# EAGLE design rev6_1 (EAGLE 9.6.2)
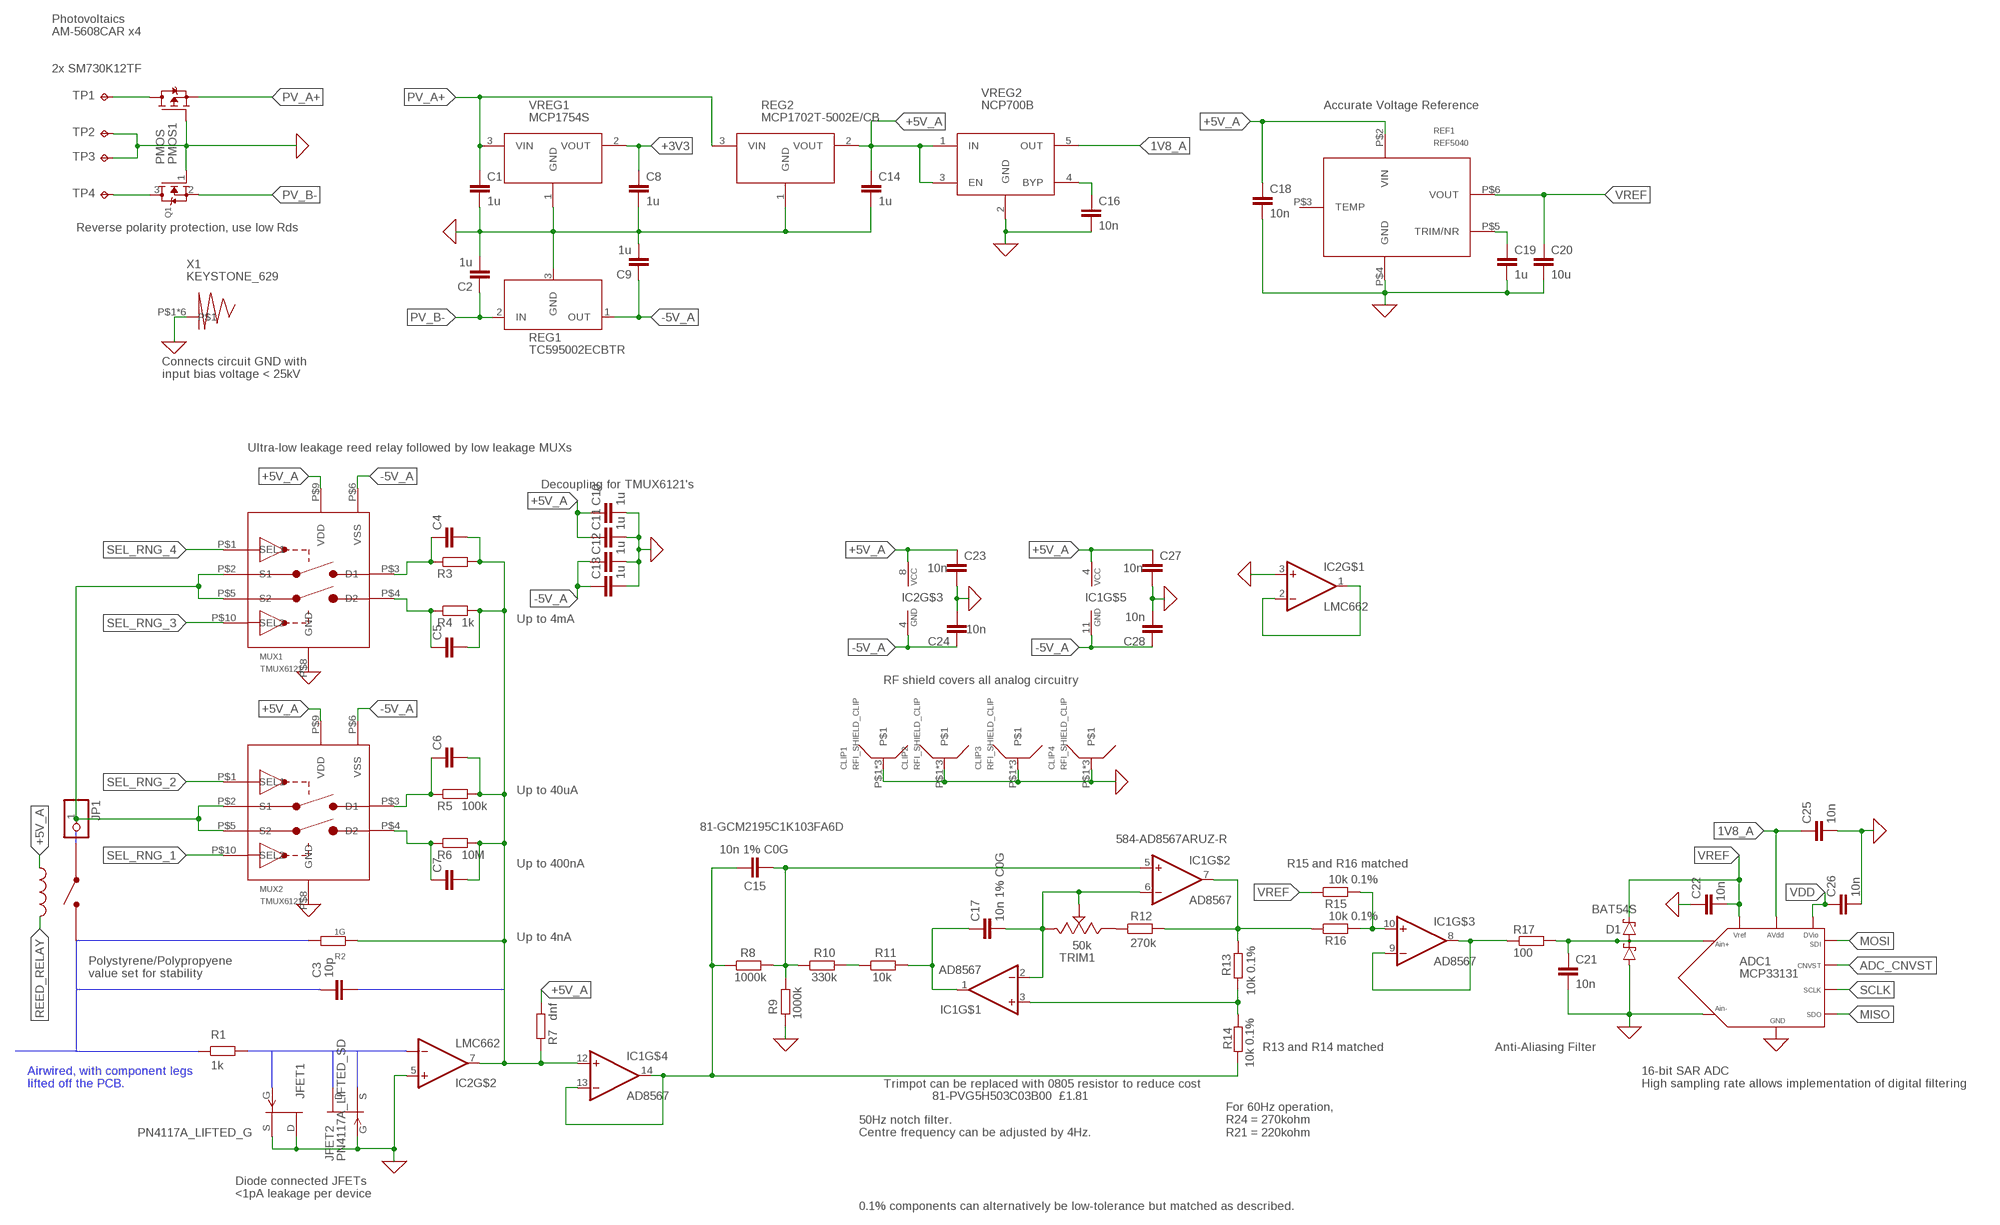
[diagram p0: schematic, sheet 1, part 1 of 2]
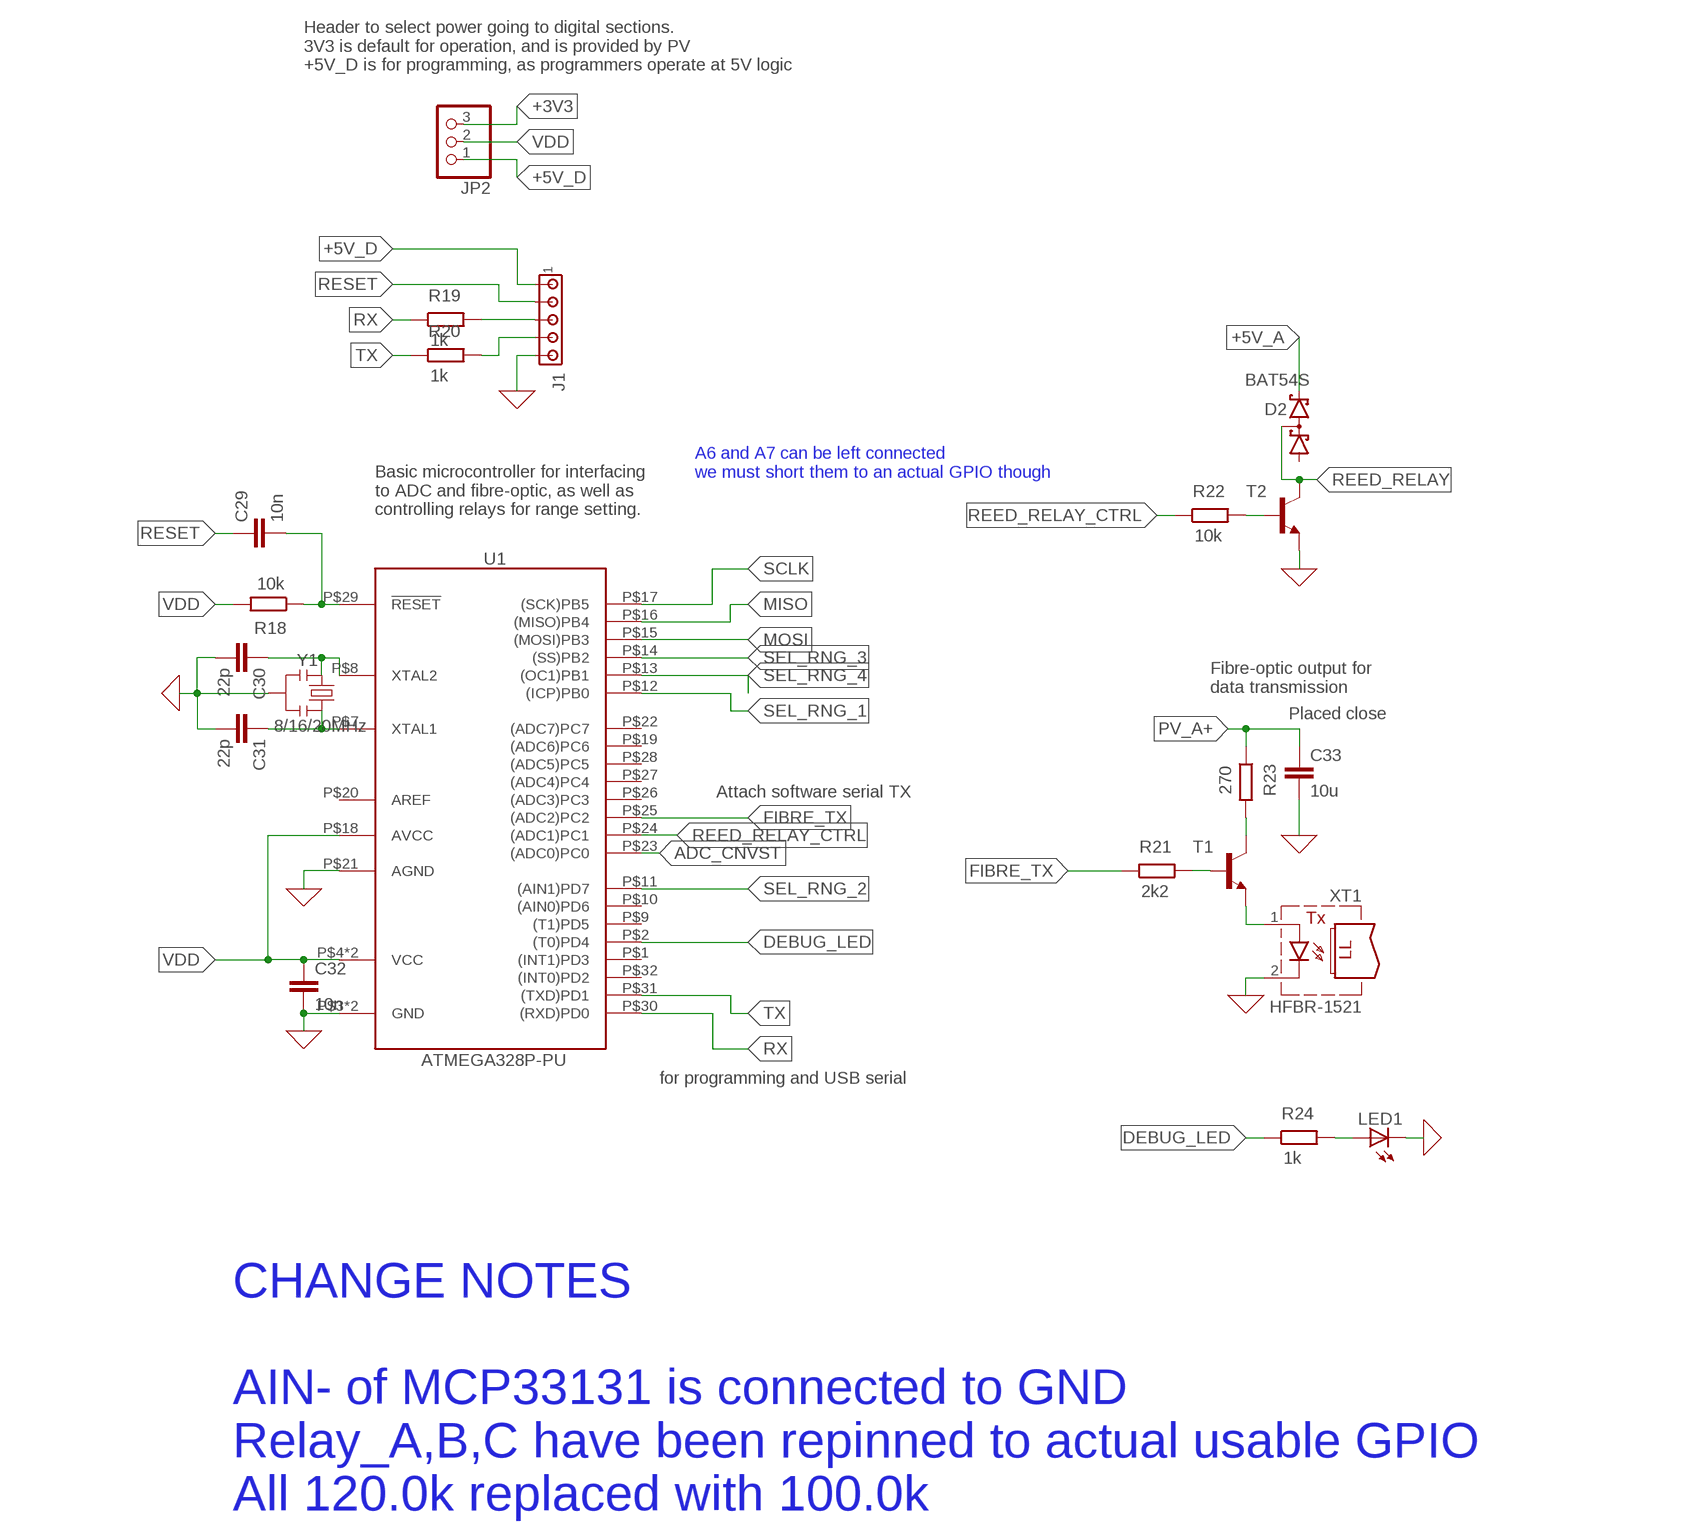
[diagram p1: schematic, sheet 1, part 2 of 2]

## Parts
ADC1  MCP33131  [MSOP10]
C1  1u  C-EUC0805  [C0805]
C2  1u  C-EUC0805  [C0805]
C3  10p  C  (no package)
C4  C-EUC0805  [C0805]
C5  C-EUC0805  [C0805]
C6  C-EUC0805  [C0805]
C7  C-EUC0805  [C0805]
C8  1u  C-EUC0805  [C0805]
C9  1u  C-EUC0805  [C0805]
C10  1u  C-EUC0805  [C0805]
C11  1u  C-EUC0805  [C0805]
C12  1u  C-EUC0805  [C0805]
C13  1u  C-EUC0805  [C0805]
C14  1u  C-EUC0805  [C0805]
C15  10n 1% C0G  C-EUC1206  [C1206]
C16  10n  C-EUC0805  [C0805]
C17  10n 1% C0G  C-EUC1206  [C1206]
C18  10n  C-EUC0805  [C0805]
C19  1u  C-EUC0805  [C0805]
C20  10u  C-EUC0805  [C0805]
C21  10n  C-EUC0805  [C0805]
C22  10n  C-EUC0805  [C0805]
C23  10n  C-EUC0805  [C0805]
C24  10n  C-EUC0805  [C0805]
C25  10n  C-EUC0805  [C0805]
C26  10n  C-EUC0805  [C0805]
C27  10n  C-EUC0805  [C0805]
C28  10n  C-EUC0805  [C0805]
C29  10n  C-EUC0805  [C0805]
C30  22p  C-EUC0805  [C0805]
C31  22p  C-EUC0805  [C0805]
C32  10n  C-EUC0805  [C0805]
C33  10u  C-EUC0805  [C0805]
CLIP1  RFI_SHIELD_CLIP  [RFI_SHIELD_CLIP]
CLIP2  RFI_SHIELD_CLIP  [RFI_SHIELD_CLIP]
CLIP3  RFI_SHIELD_CLIP  [RFI_SHIELD_CLIP]
CLIP4  RFI_SHIELD_CLIP  [RFI_SHIELD_CLIP]
D1  BAT54S  [SOT23]
D2  BAT54S  [SOT23]
IC1  AD8567  TLV9354QPWRQ1  [TSSOP14]
IC2  LMC662  [DIL8_LIFTED]
J1  MTA05-100  [10X05MTA]
JFET1  PN4117A_LIFTED_G  [TO-92_LIFTED_GATE]
JFET2  PN4117A_LIFTED_SD  [TO92_LIFTED_SOURCE_DRAIN]
JP1  PINHD-1X1  [1X01]
JP2  PINHD-1X3  [1X03]
LED1  LEDCHIPLED_0805  [CHIPLED_0805]
MUX1  TMUX6121  [VSSOP-10]
MUX2  TMUX6121  [VSSOP-10]
PMOS1  PMOS  [SOT23]
Q1  MOSFET-NREFLOW  [SOT23]
R1  1k  R  (no package)
R2  1G  THICK_FILM_RESISTOR  [1GOHM_HALF_LIFTED]
R3  R-EU_R0805  [R0805]
R4  1k  R-EU_R0805  [R0805]
R5  100k  R-EU_R0805  [R0805]
R6  10M  R-EU_R0805  [R0805]
R7  dnf  R-EU_R0805  [R0805]
R8  1000k  R-EU_R0805  [R0805]
R9  1000k  R-EU_R0805  [R0805]
R10  330k  R-EU_R0805  [R0805]
R11  10k  R-EU_R0805  [R0805]
R12  270k  R-EU_R0805  [R0805]
R13  10k 0.1%  R-EU_R0805  [R0805]
R14  10k 0.1%  R-EU_R0805  [R0805]
R15  10k 0.1%  R-EU_R0805  [R0805]
R16  10k 0.1%  R-EU_R0805  [R0805]
R17  100  R-EU_R0805  [R0805]
R18  10k  R-EU_R0805  [R0805]
R19  1k  R-EU_R0805  [R0805]
R20  1k  R-EU_R0805  [R0805]
R21  2k2  R-EU_R0805  [R0805]
R22  10k  R-EU_R0805  [R0805]
R23  270  R-EU_R0805  [R0805]
R24  1k  R-EU_R0805  [R0805]
REF1  REF5040  [VSSOP-8_]
REG1  TC595002ECBTR  [SOT23]
REG2  MCP1702T-5002E/CB  [SOT23]
RLY1  HI05-1A66_REED_RELAY  [HI05-1A66]
T1  BC847A-NPN-SOT23-BEC  [SOT23-BEC]
T2  BC847A-NPN-SOT23-BEC  [SOT23-BEC]
TP1  TPPAD1-13  [P1-13]
TP2  TPPAD1-13  [P1-13]
TP3  TPPAD1-13  [P1-13]
TP4  TPPAD1-13  [P1-13]
TRIM1  50k  TRIMPOT  [PVG5H]
U1  ATMEGA328P-PU  [TQFP-32]
VREG1  MCP1754S  [SOT23]
VREG2  NCP700B  [TSOP-5]
X1  KEYSTONE_629  [SPRING_CONTACT]
XT1  HFBR-1521  [HFBR-15X3]
Y1  8/16/20MHz  RESONATOR1:1  [RESONATOR-SMD-1:1]

## Nets
0: ADC1.4(AIN-) ADC1.5(GND) C1.2 C2.2 C8.2 C9.2 C10.2 C11.2 C12.2 C13.2 C14.2 C16.2 C18.2 C19.2 C20.2 C21.2 C22.1 C23.2 C24.2 C25.2 C26.2 C27.2 C28.2 C30.2 C31.2 C32.2 C33.2 CLIP1.P$1 CLIP1.P$2 CLIP1.P$3 CLIP2.P$1 CLIP2.P$2 CLIP2.P$3 CLIP3.P$1 CLIP3.P$2 CLIP3.P$3 CLIP4.P$1 CLIP4.P$2 CLIP4.P$3 D1.1(A1) IC2.3(+IN) IC2.5(+IN) J1.5 JFET1.P$2(D) JFET1.P$3(S) JFET2.P$1(G) LED1.C MUX1.P$8(GND) MUX2.P$8(GND) PMOS1.1(G) Q1.1(G) R9.1 REF1.P$4(GND) REG1.3(GND) REG2.1(GND) T2.E TP2.TP TP3.TP U1.P$3(GND) U1.P$5(GND) U1.P$21(AGND) VREG1.1(GND) VREG2.2(GND) X1.P$1 X1.P$2 X1.P$3 X1.P$4 X1.P$5 X1.P$6 XT1.2(C) Y1.2 ; supply symbol labelled GND
1V8_A: ADC1.2(AVDD) C25.1 VREG2.5(OUT)
+3V3: C8.1 JP2.3 VREG1.2(VOUT)
+5V_A: C10.1 C11.1 C14.1 C18.1 C23.1 C27.1 D2.2(C2) IC1.4(VCC) IC2.8(VCC) MUX1.P$9(VDD) MUX2.P$9(VDD) R7.2 REF1.P$2(VIN) REG2.2(VOUT) RLY1.P$5 VREG2.1(IN) VREG2.3(EN)
+5V_D: J1.1 JP2.1
-5V_A: C9.1 C12.1 C13.1 C24.1 C28.1 IC1.11(GND) IC2.4(GND) MUX1.P$6(VSS) MUX2.P$6(VSS) REG1.1(OUT)
ADC_CNVST: ADC1.6(CNVST) U1.P$23((ADC0)PC0)
DEBUG_LED: R24.1 U1.P$2((T0)PD4)
FIBRE_TX: R21.1 U1.P$25((ADC2)PC2)
MISO: ADC1.7(SDO) U1.P$16((MISO)PB4)
MOSI: ADC1.9(SDI) U1.P$15((MOSI)PB3)
N$1: IC2.1(OUT) IC2.2(-IN)
N$2: IC1.8(OUT) IC1.9(-IN) R17.1
N$4: R21.2 T1.B
N$5: IC1.10(+IN) R15.2 R16.2
N$6: ADC1.3(AIN+) C21.1 D1.3(C1A2) R17.2
N$7: R23.2 T1.C
N$8: C30.1 U1.P$8(XTAL2) Y1.1
N$9: C19.1 REF1.P$5(TRIM/NR)
N$10: C31.1 U1.P$7(XTAL1) Y1.3
N$11: JP1.1 MUX1.P$2(S1) MUX1.P$5(S2) MUX2.P$2(S1) MUX2.P$5(S2)
N$12: C4.1 MUX1.P$3(D1) R3.1
N$14: R22.2 T2.B
N$15: C17.2 IC1.2(-IN) IC1.6(-IN) TRIM1.B(E) TRIM1.W(S)
N$16: T1.E XT1.1(A)
N$20: IC1.7(OUT) R12.2 R13.1 R16.1
N$21: R10.2 R11.1
N$22: IC1.3(+IN) R13.2 R14.1
N$24: C4.2 C5.2 C6.2 C7.2 IC1.12(+IN) IC2.7(OUT) R2.2 R3.2 R4.2 R5.2 R6.2 R7.1
N$25: C15.1 IC1.13(-IN) IC1.14(OUT) R8.1 R14.2
N$26: C29.2 R18.1 U1.P$29(!RESET)
N$27: C15.2 IC1.5(+IN) R8.2 R9.2 R10.1
N$28: LED1.A R24.2
N$29: C16.1 VREG2.4(BYP)
N$30: C7.1 MUX2.P$4(D2) R6.1
N$31: J1.3 R19.2
N$32: J1.4 R20.2
N$33: C6.1 MUX2.P$3(D1) R5.1
N$34: C5.1 MUX1.P$4(D2) R4.1
N$35: R12.1 TRIM1.A
N$36: Q1.3(D) TP4.TP
N$37: C17.1 IC1.1(OUT) R11.2
N$38: PMOS1.3(D) TP1.TP
PV_A+: C1.1 C33.1 PMOS1.2(S) R23.1 REG2.3(VIN) VREG1.3(VIN)
PV_B-: C2.1 Q1.2(S) REG1.2(IN)
REED_RELAY: D2.3(C1A2) RLY1.P$3 T2.C
REED_RELAY_CTRL: R22.1 U1.P$24((ADC1)PC1)
RESET: C29.1 J1.2
RX: R19.1 U1.P$30((RXD)PD0)
SCLK: ADC1.8(SCLK) U1.P$17((SCK)PB5)
SEL_RNG_1: MUX2.P$10(SEL2) U1.P$12((ICP)PB0)
SEL_RNG_2: MUX2.P$1(SEL1) U1.P$11((AIN1)PD7)
SEL_RNG_3: MUX1.P$10(SEL2) U1.P$14((SS)PB2)
SEL_RNG_4: MUX1.P$1(SEL1) U1.P$13((OC1)PB1)
TX: R20.1 U1.P$31((TXD)PD1)
VDD: ADC1.10(DVIO) C26.1 C32.1 JP2.2 R18.2 U1.P$4(VCC) U1.P$6(VCC) U1.P$18(AVCC)
VREF: ADC1.1(VREF) C20.1 C22.2 D1.2(C2) R15.1 REF1.P$6(VOUT)
Unconnected: C3.1 C3.2 D2.1(A1) R1.1 R1.2 REF1.P$3(TEMP) U1.P$1((INT1)PD3) U1.P$9((T1)PD5) U1.P$10((AIN0)PD6) U1.P$19((ADC6)PC6) U1.P$20(AREF) U1.P$22((ADC7)PC7) U1.P$26((ADC3)PC3) U1.P$27((ADC4)PC4) U1.P$28((ADC5)PC5) U1.P$32((INT0)PD2)

## Notes on the sheet
- Photovoltaics
  AM-5608CAR x4
- 2x SM730K12TF
- Accurate Voltage Reference
- Header to select power going to digital sections.
  3V3 is default for operation, and is provided by PV
  +5V_D is for programming, as programmers operate at 5V logic
- Reverse polarity protection, use low Rds
- Connects circuit GND with
  input bias voltage < 25kV
- Basic microcontroller for interfacing
  to ADC and fibre-optic, as well as 
  controlling relays for range setting.
- A6 and A7 can be left connected
  we must short them to an actual GPIO though
- Ultra-low leakage reed relay followed by low leakage MUXs
- Decoupling for TMUX6121's
- Fibre-optic output for
  data transmission
- Placed close
- Attach software serial TX
- Up to 4mA
- RF shield covers all analog circuitry
- Up to 40uA
- for programming and USB serial
- 81-GCM2195C1K103FA6D
- 584-AD8567ARUZ-R
- Up to 400nA | R15 and R16 matched
- Up to 4nA
- Polystyrene/Polypropyene
  value set for stability
- R13 and R14 matched | Anti-Aliasing Filter
- Airwired, with component legs
  lifted off the PCB.
- Trimpot can be replaced with 0805 resistor to reduce cost
- 16-bit SAR ADC
  High sampling rate allows implementation of digital filtering
- 81-PVG5H503C03B00  £1.81
- CHANGE NOTES
  
  AIN- of MCP33131 is connected to GND
  Relay_A,B,C have been repinned to actual usable GPIO
  All 120.0k replaced with 100.0k
- 50Hz notch filter. 
  Centre frequency can be adjusted by 4Hz.
- For 60Hz operation,
  R24 = 270kohm
  R21 = 220kohm
- Diode connected JFETs
  <1pA leakage per device
- 0.1% components can alternatively be low-tolerance but matched as described.

## Library data of the parts
ADC1 = josh:MCP33131: MCP33131 16-bit SAR ADC
C1 C2 C4-C33 = rcl:C-EU: CAPACITOR, European symbol; SPICEPREFIX: C
C3 = ngspice-simulation:C: CAPACITOR
CLIP1-CLIP4 = josh:RFI_SHIELD_CLIP: Harwin RFI Shield Clip https://docs.rs-online.com/97ab/0900766b8148a2a0.pdf RS# 909-4473
D1 D2 = diode:BAT54S: Schottky Diodes Pin connection corrected 2011-05-04 Source: Fairchild .. BAT54.pdf
IC1 = josh:TLV9354QPWRQ1: Quad Op-Amp TLV9354QPWRQ1
IC2 = josh:LMC662: LMC662 Dual CMOS Op-Amp Pin 5 is lowest leakage, and is lifted from the board.
J1 = con-amp:MTA05-100: AMP connector
JFET1 = josh:PN4117A_LIFTED_G: PN4117A JFET with lifted gate for reduced leakage
JFET2 = josh:PN4117A_LIFTED_SD
JP1 = adafruit:PINHD-1X1: Pin header 1x1 for 0.1" spacing With round pins
JP2 = adafruit:PINHD-1X3: PIN HEADER
LED1 = adafruit:LED: LED OSRAM: - CHIPLED LG R971, LG N971, LY N971, LG Q971, LY Q971, LO R971, LY R971 LH N974, LH R974 LS Q976, LO Q976, LY Q976 LO Q996 - Hyper CHIPLED LW Q18S LB Q993, LB Q99A, LB R99A - SideLED LS A670, LO A670, LY A670, LG A670, LP A670 LB A673, LV A673, LT A673, LW A673 LH A674 LY A675 LS A676, LA A676, LO A676, LY A676, LW A676 LS A679, LY A679, LG A679 - Hyper Micro SIDELED® LS Y876, LA Y876, LO Y876, LY Y876 LT Y87S - SmartLED LW L88C, LW L88S LB L89C, LB L89S, LG L890 LS L89K, LO L89K, LY L89K LS L896, LA L896, LO L896, LY L896 - TOPLED LS T670, LO T670, LY T670, LG T670, LP T670 LSG T670, LSP T670, LSY T670, LOP T670, LYG T670 LG T671, LOG T671, LSG T671 LB T673, LV T673, LT T673, LW T673 LH T674 LS T676, LA T676, LO T676, LY T676, LB T676, LH T676, LSB T676, LW T676 LB T67C, LV T67C, LT T67C, LS T67K, LO T67K, LY T67K, LW E67C LS E67B, LA E67B, LO E67B, LY E67B, LB E67C, LV E67C, LT E67C LW T67C LS T679, LY T679, LG T679 LS T770, LO T770, LY T770, LG T770, LP T770 LB T773, LV T773, LT T773, LW T773 LH T774 LS E675, LA E675, LY E675, LS T675 LS T776, LA T776, LO T776, LY T776, LB T776 LHGB T686 LT T68C, LB T68C - Hyper Mini TOPLED® LB M676 - Mini TOPLED Santana® LG M470 LS M47K, LO M47K, LY M47K Source: http://www.osram.convergy.de/
MUX1 MUX2 = josh:TMUX6121: TMUX6121 ±16.5-V, Low-Capacitance, Low-Leakage-Current, Precision, Dual SPST Switches https://www.ti.com/lit/ds/symlink/tmux6123.pdf?HQS=dis-mous-null-mousermode-dsf-pf-null-wwe&ts=1675331200005&ref_url=https%253A%252F%252Fwww.mouser.co.uk%252F
PMOS1 = josh:PMOS
Q1 = adafruit:MOSFET-N: N-Channel Mosfet 2N7002E - 60V 260mA SOT23 [Digikey: 2N7002ET1GOSTR-ND] - REEL BSH103 - 30V 850mA SOT23 [Digikey: 568-5013-1-ND]
R1 = ngspice-simulation:R: RESISTOR
R2 = josh:THICK_FILM_RESISTOR: SM102031007FE
R3-R24 = rcl:R-EU_: RESISTOR, European symbol; SPICEPREFIX: R
REF1 = josh:REF5040: REF5040 Reference Voltage
REG1 = josh:TC595002ECBTR: TC595002ECBTR Negative Voltage Regulator -5V
REG2 = josh:MCP1702T-5002E/CB: MCP1702T-5002E/CB MCP1702 Positive voltage Regulator 5V +5V
RLY1 = josh:HI05-1A66_REED_RELAY: Reed Relay High Insulation Reed Relay HI05-1A66
T1 T2 = transistor:*-NPN-: NPN Transistror BF959 corrected 2008.03.06
TP1-TP4 = testpad:TP: Test pad
TRIM1 = josh:TRIMPOT: Trimpot https://www.mouser.co.uk/datasheet/2/54/pvg5-907351.pdf
U1 = josh:ATMEGA328P-PU: ATMEGA328P-PU Microcontroller
VREG1 = josh:MCP1754S: 3.3V 3V3 Voltage Regulator
VREG2 = josh:NCP700B: NCP700B Voltage Regulator RS Stock No.: 757-7150 Mfr. Part No.: NCP700BSN18T1G
X1 = josh:KEYSTONE_629: Keystone 629 Spring Contact
XT1 = fiber-optic-hp:HFBR-1521: TRANSMITTER low cost miniature fiber optic component, 5-MBd high performance link, vertical; MF: AGILENT TECHNOLOGIES; MPN: HFBR-1521; OC_FARNELL: 1173128; OC_NEWARK: 06F6050
Y1 = Testing:RESONATOR: Resonator Small SMD resonator. This is the itty bitty 10/20MHz resonators with built in caps. CSTCE10M0G55 and CSTCE20M0V53. Footprint for SMD has been used in SFE production for years, and does work okay. 1:1 is an attempt to get larger fillets on the sides so it will be easier to inspect these solders in our AOI machine. The pads have been minimized to match the actual metal under the resonator. To see this relation, it includes an image import of the bottom side of the component. Imported to scale on layer 200.

## Board
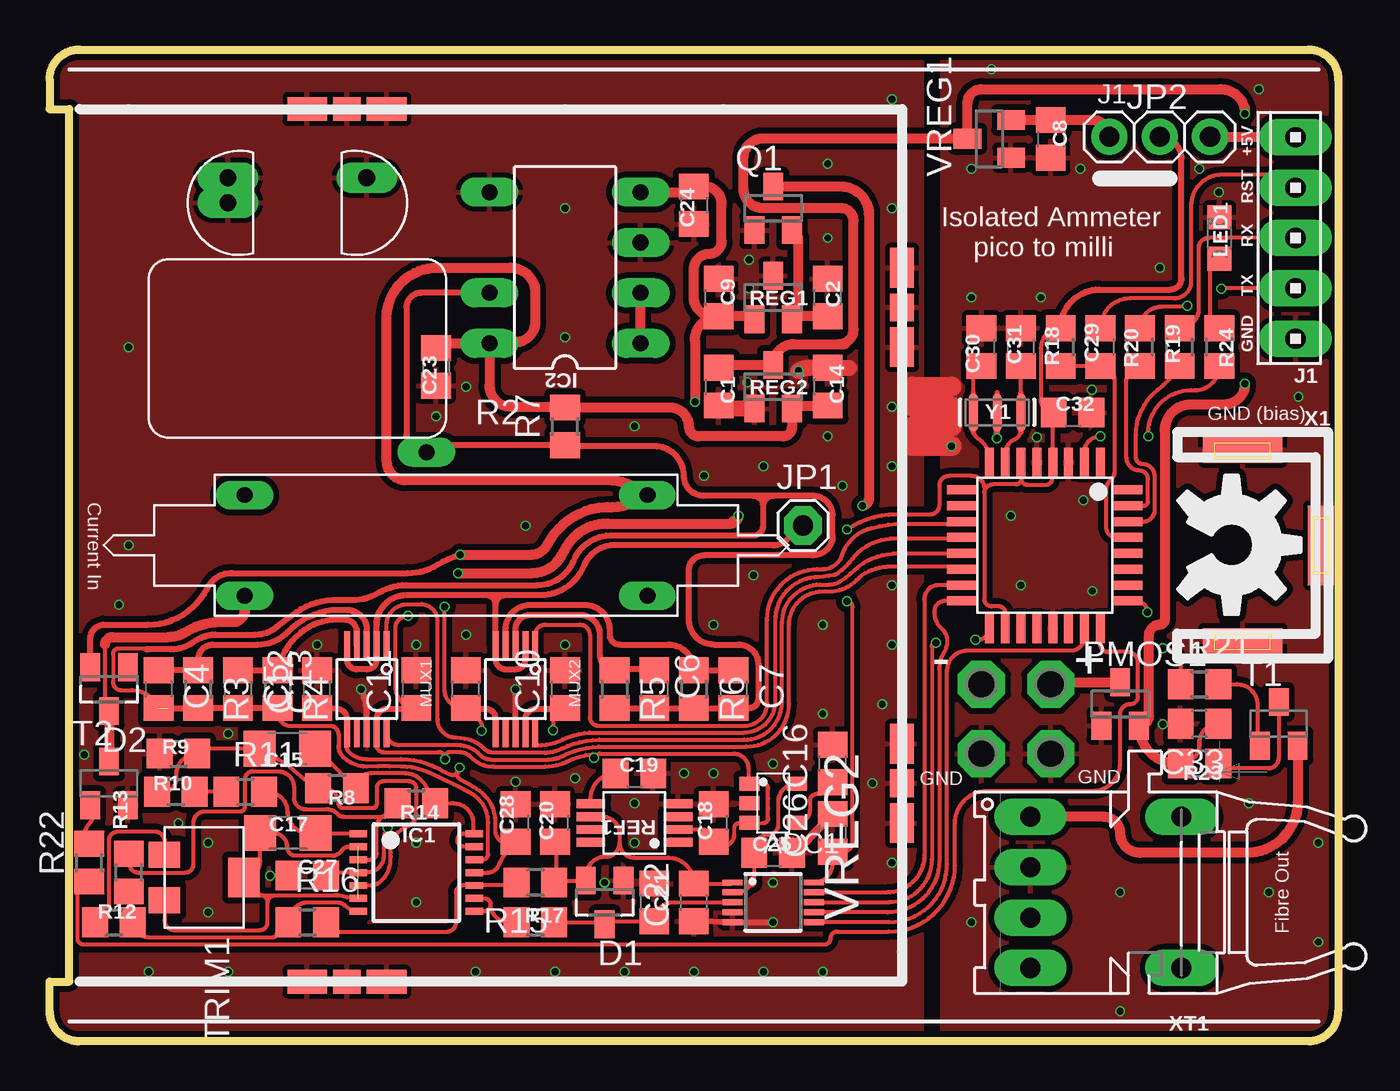
[diagram p2: board, top side]
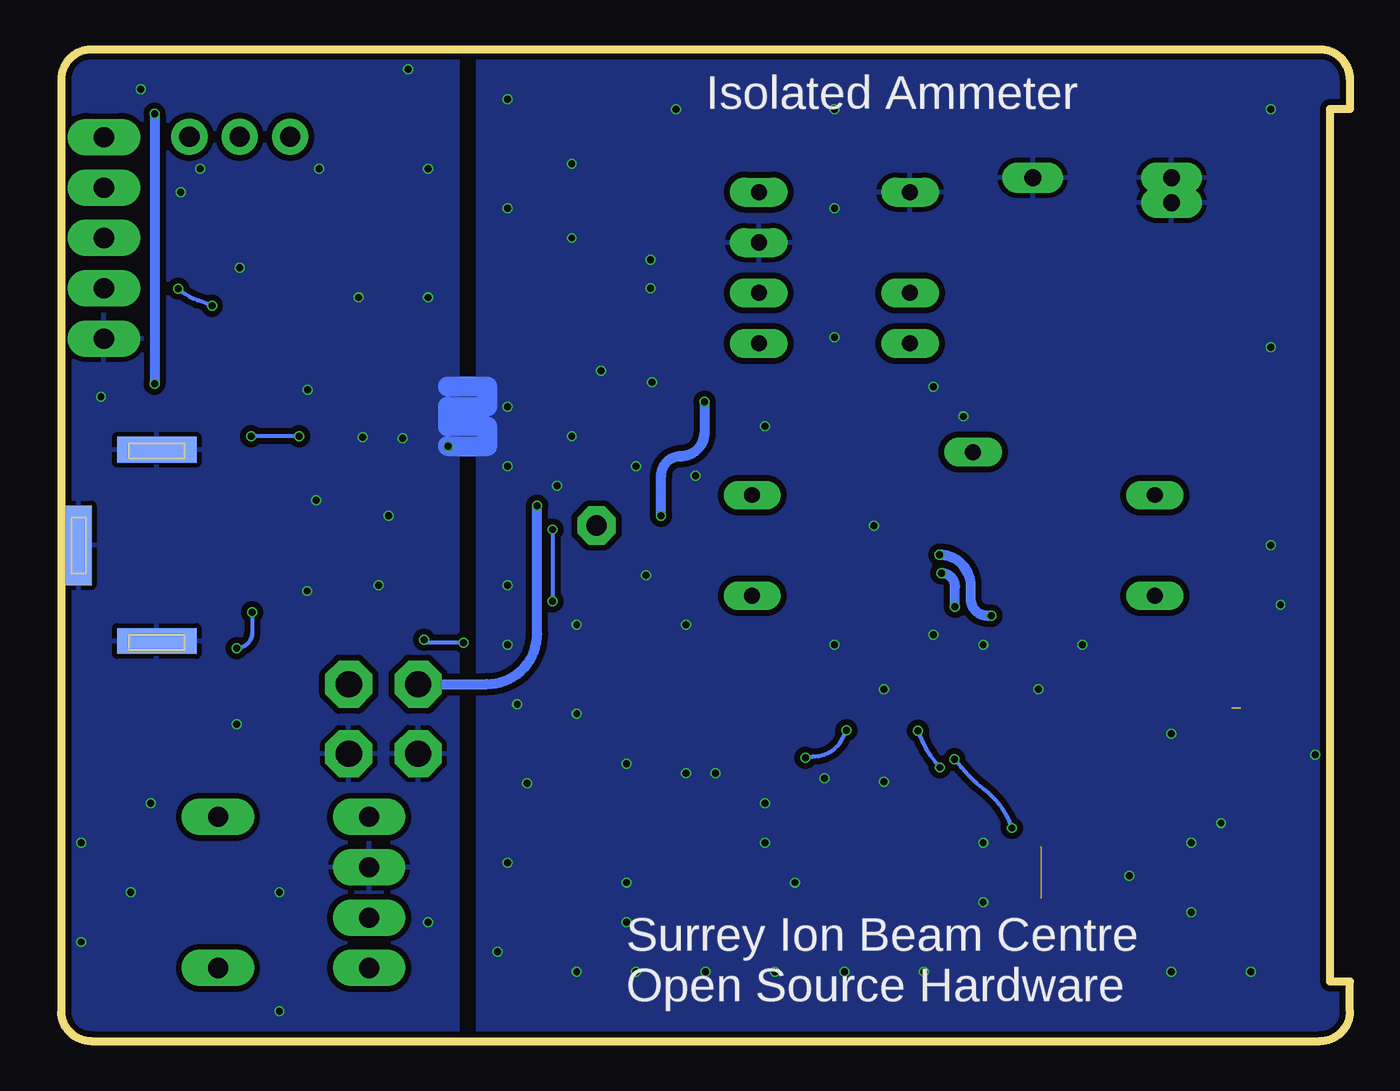
[diagram p3: board, bottom side, seen from below]

Size 65 x 50 mm. Coordinates in mm from the lower left corner, seen from the top.
Outline: 1,3 1,47 0,47 0,48.5 arc-90 1.5,50 63.5,50 arc-90 65,48.5 65,1.5 arc-90 63.5,0 1.5,0 arc-90 0,1.5 0,3 1,3
Copper layers (1*16): Top 0.035mm / dielectric 1.6mm / Bottom 0.035mm
Design rules "jlcpcb-2layers": minimum track width 5mil, minimum drill 0.3mm, track to track 5mil, track to pad 5mil, pad to pad 5mil, via to via 5mil, smd to smd 5mil, copper to edge 0.2mm, drill to drill 6mil, minimum pad ring 10mil, minimum via ring 3mil, stop-mask expansion 4mil, vias tented up to drill 0mil, thermal gap 10mil

### Footprints (pad centres in the part's own frame; a part is rotated, then mirrored left to right if it is on the bottom)
MSOP10 = smd 0.3 x 1: 1 -1,-2.05; 2 -0.5,-2.05; 3 0,-2.05; 4 0.5,-2.05; 5 1,-2.05; 6 1,2.05; 7 0.5,2.05; 8 0,2.05; 9 -0.5,2.05; 10 -1,2.05
C0805 = smd 1.3 x 1.5: 1 -0.95,0; 2 0.95,0
C1206 = smd 1.6 x 1.8: 1 -1.4,0; 2 1.4,0
RFI_SHIELD_CLIP = smd 1.4 x 1.2: P$1 0,0 | smd 2 x 1.2: P$2 -2,0; P$3 2,0
SOT23 = smd 1 x 1.4: 1 -0.95,-1.1; 2 0.95,-1.1; 3 0,1.1
TSSOP14 = smd 0.35 x 0.9: 1 -1.95,-2.925; 2 -1.3,-2.925; 3 -0.65,-2.925; 4 0,-2.925; 5 0.65,-2.925; 6 1.3,-2.925; 7 1.95,-2.925; 8 1.95,2.925; 9 1.3,2.925; 10 0.65,2.925; 11 0,2.925; 12 -0.65,2.925; 13 -1.3,2.925; 14 -1.95,2.925
DIL8_LIFTED = drill 0.813 long: 1 -3.81,-3.81; 2 -1.27,-3.81; 3 1.27,-3.81; 4 3.81,-3.81; 5 3.81,3.81; 7 -1.27,3.81; 8 -3.81,3.81
10X05MTA = drill 1.016 long: 1 5.08,0; 2 2.54,0; 3 0,0; 4 -2.54,0; 5 -5.08,0
TO-92_LIFTED_GATE = drill 0.85 pad 0.61 long: P$2 1.27,0; P$3 2.54,0
TO92_LIFTED_SOURCE_DRAIN = drill 0.85 pad 0.61 long: P$1 0,0
1X01 = drill 1.016 pad 1.93 octagon: 1 0,0
1X03 = drill 1.016: 1 -2.54,0; 2 0,0; 3 2.54,0
CHIPLED_0805 = smd 1.2 x 1.2: A 0,-1.05; C 0,1.05
VSSOP-10 = smd 1.45 x 0.3: P$1 -2.2,1; P$2 -2.2,0.5; P$3 -2.2,0; P$4 -2.2,-0.5; P$5 -2.2,-1; P$6 2.2,-1; P$7 2.2,-0.5; P$8 2.2,0; P$9 2.2,0.5; P$10 2.2,1
1GOHM_HALF_LIFTED = drill 0.813 long: 2 6.01,0
R0805 = smd 1.3 x 1.5: 1 -0.95,0; 2 0.95,0
VSSOP-8_ = smd 0.45 x 1.45: P$1 -0.975,-2.2; P$2 -0.325,-2.2; P$3 0.325,-2.2; P$4 0.975,-2.2; P$5 0.975,2.2; P$6 0.325,2.2; P$7 -0.325,2.2; P$8 -0.975,2.2
HI05-1A66 = drill 0.8 long: P$3 10.16,2.54; P$4 10.16,-2.54; P$5 -10.16,-2.54; P$6 -10.16,2.54
SOT23-BEC = smd 1 x 1.4: B -0.95,-1.1; C 0,1.1; E 0.95,-1.1
P1-13 = drill 1.321 pad 2.159 octagon: TP 0,0
PVG5H = smd 1.3 x 1.6: A -1.15,-4; B 1.15,-4 | smd 2 x 1.6: W 0,0
TQFP-32 = smd 0.45 x 1.45: P$1 0,0; P$2 0.8,0; P$3 1.6,0; P$4 2.4,0; P$5 3.2,0; P$6 4,0; P$7 4.8,0; P$8 5.6,0; P$17 5.6,8.4; P$18 4.8,8.4; P$19 4,8.4; P$20 3.2,8.4; P$21 2.4,8.4; P$22 1.6,8.4; P$23 0.8,8.4; P$24 0,8.4 | smd 1.45 x 0.45: P$9 7,1.4; P$10 7,2.2; P$11 7,3; P$12 7,3.8; P$13 7,4.6; P$14 7,5.4; P$15 7,6.2; P$16 7,7; P$25 -1.4,7; P$26 -1.4,6.2; P$27 -1.4,5.4; P$28 -1.4,4.6; P$29 -1.4,3.8; P$30 -1.4,3; P$31 -1.4,2.2; P$32 -1.4,1.4
TSOP-5 = smd 0.7 x 1: 1 -0.99,-1.2; 2 0,-1.2; 3 0.99,-1.2; 4 0.99,1.2; 5 -0.99,1.2
SPRING_CONTACT = smd 1.3 x 4 bottom: P$1 0.381,0 | smd 4 x 1.3 bottom: P$2 4.318,4.826; P$6 4.318,-4.826 | smd 4 x 1.3: P$3 4.318,-4.826; P$5 4.318,4.826 | smd 1.3 x 4: P$4 0.381,0
HFBR-15X3 = drill 1.016 long: 1 3.81,9.525; 2 1.27,9.525; 3 -1.27,9.525; 4 -3.81,9.525; 5 -3.81,1.905; 8 3.81,1.905
RESONATOR-SMD-1:1 = smd 0.45 x 1.905: 1 -1.2,0; 2 0,0; 3 1.2,0

### Placement (x,y rotation side)
ADC1  36.5,7 270 top
C1  33.75,33 270 top
C2  39.25,37.5 90 top
C4  5.5,17.75 270 top
C5  9.5,17.75 270 top
C6  30.5,17.75 270 top
C7  34.5,17.75 270 top
C8  50.5,45.5 270 top
C9  33.75,37.5 90 top
C10  26,17.75 90 top
C11  18.5,17.75 90 top
C12  13.5,17.75 90 top
C13  21,17.75 90 top
C14  39.25,33 90 top
C15  12,14.75 180 top
C16  39.5,14 90 top
C17  12.03,10.5 180 top
C18  33.5,11 90 top
C19  29.5,13.5 0 top
C20  25.5,11 90 top
C21  30.5,7 90 top
C22  32.5,7 90 top
C23  19.5,34 270 top
C24  32.5,42.15 270 top
C25  36.5,9.5 0 top
C26  39.5,10.5 90 top
C27  13,8.35 180 top
C28  23.5,11 90 top
C29  53,35 270 top
C30  47,35 90 top
C31  49,35 90 top
C32  51.6,31.7 0 top
C33  58,16 180 top
CLIP1  43,37 90 top
CLIP2  43,13 90 top
CLIP3  15,3 0 top
CLIP4  15,47 0 top
D1  28,7 180 top
D2  3,17.75 180 top
IC1  18.5,8.5 270 top
IC2  26,39 90 top
J1  62.85,40.5 90 top
JFET1  9,41 90 top
JFET2  16,43.54 270 top
JP1  38,26 0 top
JP2  56,45.6 180 top
LED1  59,40.5 0 top
MUX1  16,17.75 270 top
MUX2  23.5,17.75 270 top
PMOS1  54,17 0 top
Q1  36.5,42 0 top
R2  13,29.7 0 top
R3  7.5,17.75 270 top
R4  11.5,17.75 270 top
R5  28.5,17.75 270 top
R6  32.5,17.75 270 top
R7  26,31 90 top
R8  14.5,12.75 180 top
R9  6.5,14.5 0 top
R10  6.38,12.57 0 top
R11  9.88,12.57 0 top
R12  3.25,6 0 top
R13  4,8.5 90 top
R14  18.5,12 0 top
R15  24.5,8 180 top
R16  13,6 0 top
R17  24.5,6 0 top
R18  51,35 90 top
R19  57,35 90 top
R20  55,35 90 top
R21  58,18 0 top
R22  2,9 90 top
R23  58,14 0 top
R24  59,35 90 top
REF1  29.5,11 90 top
REG1  36.5,37.5 0 top
REG2  36.5,33 0 top
RLY1  20,25 180 top
T1  62,16 0 top
T2  3,13 0 top
TP1  50.5,18 0 top
TP2  50.5,14.5 0 top
TP3  47,14.5 0 top
TP4  47,18 0 top
TRIM1  9.8,8.25 270 top
U1  53,29.2 180 top
VREG1  47.4,45.5 90 top
VREG2  36.5,12 270 top
X1  64.5,25 180 top
XT1  59,7.5 90 top
Y1  47.8,31.7 0 top

### Tracks (layer width: path | path; a pad name or v marks a point on that pad's centre or on a via)
0  (via drill 0.35)
  Top 0.3: MUX2.P$8 v23.5,17.75 | C22.1 ADC1.5 v36.5,6 | MUX1.P$8 16,16.57 arc26 v15.72,17.75 | v47.77,30.4 Y1.2 | v56.15,15.97 C33.2
  Top 0.4: C26.2 37.92,9.82 arc-23 C25.2
  Top 0.8: REG2.1 34.55,31.9 arc-21 C1.2 | v37.77,33.8 arc-31 38.33,33.95 C14.2 40.33,33.95
  Top 1: v45.5,30 43.5,30 43.5,31 45.5,31 45.5,32 43.5,32 43.5,33 45.5,33
  Bottom 1: v45.5,30 43.5,30 43.5,31 45.5,31 45.5,32 43.5,32 43.5,33 45.5,33
  other vias: 19.5,31.5 21,33 29.5,31 33,28.5 36,29 39.25,30.5 40,28 42.5,29 42.5,32 42.5,42 39.25,44.25 39.25,40.5 35.27,37.98 35.27,39.4 26,35.5 26,42 42.5,47.5 34,47 26,47 35.2,33.23 24,26 4,47 4,35 4,25 3.5,22 18.5,20 21,20.5 26,20 13.5,20 9,15.5 1.75,14.45 8,6.5 8,10 6.5,11 11.12,8.35 5,3.5 9,3.5 18.5,10 18.5,7 26.5,13.25 23.5,13.07 29.5,12 29.5,10 32,13.5 33.5,13.5 36.5,14 39,16.5 36.5,8 28,8 21.5,3.5 25.5,3.5 29,3.5 32.5,3.5 36,3.5 39,3.5 43,4.5 42.5,9 41.5,13 42,17 42.5,20 39,21 35.5,23.5 33.5,21 42.5,23 46.5,44 46.5,37.5 50,37.5 56,39 52,44 47.5,49 61,48 58.98,42.8 58,44 63,32.5 60.5,12 61.5,7.5 64,10 64,5 54,7.5 46.5,6 54,1.5 48.5,26.5 52.6,22.7 52.15,27.27 49,23 52.58,32.85 49.8,30.45
  pour Top (isolate 0.3): 45,51 45,-1 66,-1 66,51
  pour Bottom (isolate 0.3): 45,52 45,-2 67,-2 67,52
  pour Top (isolate 0.3): 44,51 44,-1 -1,-1 -1,51
  pour Bottom (isolate 0.3): 44,52 44,-2 -2,-2 -2,52
1V8_A
  Top 0.2: ADC1.2 34.7,7.5 arc90 35.4,8.2 35.4,7.85 arc90 35.55,8 C25.1 35.55,9.7 arc-90 36.25,10.4 arc90 36.75,10.9 36.75,12.04 arc-90 VREG2.5
+3V3
  Top 0.5: JP2.3 arc90 52.61,46.45 C8.1 VREG1.2
+5V_A  (via drill 0.35)
  Top 0.2: IC1.4 15.5,8.5 | MUX1.P$9 16.5,14.9 arc90 16.82,14.57 19.62,14.57 arc-94 v19.96,14.22 arc-112 20.2,14.57 20.68,14.57 arc-47 21.25,14.32 arc49 22.4,13.85 25,13.85 arc26 26.1,14.1 arc-24 27.73,14.5 27.74,14.5 | IC1.4 14.1,8.5 arc90 C27.1 | 27.74,14.5 34.5,14.5 arc-90 35.25,13.75 35.25,13.04 arc90 VREG2.1 35.98,12.99 arc-90 36.25,12.72 arc2 36.25,11.25 arc-92 36,11 VREG2.3 arc-90 VREG2.3 34.8,11 arc90 34.52,10.72 34.52,10.38 | C10.1 arc90 25.4,16.2 v25.4,15.68 | v27.47,14.3 27.74,14.5 | C11.1 arc-90 17.45,17.85 17.45,20.82 arc-90 v18.07,21.45 | 34.52,10.3 34.52,10.38 | REF1.P$2 32.88,10.68 arc-90 C18.1 arc90 33.67,9.88 34.02,9.88 arc90 34.52,10.38 | IC1.4 16.07,8.53 arc88 16.88,9.38 arc-1 16.88,10.18 arc-33 v17.05,10.75
  Top 0.3: MUX1.P$9 16.5,16.25 arc-90 17,16.75 18,16.75 arc11 C11.1 | MUX2.P$9 24,16.25 arc-90 24.5,16.75 25.5,16.75 arc11 C10.1 | v20.7,24.52 arc14 19.57,24.02 arc-31 18.05,23.6 9.2,23.6 arc64 8.05,22.98 arc-7 7.62,22.32 arc-53 4.97,21 2.7,21 arc84 2.05,20.27 D2.2
  Top 0.5: C23.1 arc-90 19.74,35.19 IC2.8 | IC2.8 22.19,33.06 arc90 23.25,32 25.95,32 arc-90 R7.2 31.3,31.95 arc-90 32.25,31 arc90 32.75,30.5 37,30.5 arc90 37.45,30.95 REG2.2 arc-90 37.6,32.05 C14.1 | IC2.8 arc-90 22.25,35.25 23.5,35.25 arc90 24.5,36.25 24.5,37.75 arc90 23.25,39 19.54,39 arc90 17,36.46 17,29.25 arc90 17.96,28.29 28.05,28.3 arc-40 RLY1.P$5 arc-36 28.12,26.93 arc17 27.32,26.82 arc47 25.1,25.02 arc-62 24.27,24.52 v20.7,24.52
  Bottom 0.2: v25.4,15.68 25.62,15.22 arc60 26.95,14.35 arc-4 v27.47,14.3 | v19.96,14.22 19.6,13.8 arc-11 18.45,12.7 arc33 v17.05,10.75
  Bottom 0.5: v18.07,21.45 18.27,21.45 arc90 19.12,22.3 19.12,22.95 arc-90 v20.7,24.52
+5V_D
  Top 0.5: JP2.1 62.83,45.6 arc-90 J1.1
-5V_A  (via drill 0.35)
  Top 0.2: C24.1 arc-90 32.21,42.81 | C24.1 arc-90 32.21,42.81 | C24.1 arc-90 32.21,42.81 | C24.1 arc-90 32.21,42.81 | C24.1 arc-90 32.21,42.81 | C24.1 arc-90 32.21,42.81 | C24.1 arc-90 32.21,42.81 | IC1.11 22.07,8.5 arc67 22.68,8.9 arc-26 C28.1 arc-118 22.48,10.62 arc-3 22.48,11.03 arc18 22.4,11.6 arc47 21.38,12.82 arc2 20.75,13.18 arc-109 v20.68,13.8 arc-122 20.2,13.45 arc-4 19.6,13.75 arc28 17.73,14.22 15.97,14.22 arc-44 15.1,14.57 arc-61 15,14.93 arc29 MUX1.P$6 | C13.1 21.5,16.75 | C13.1 21.65,16.2 arc-64 v21.8,15.65 | C13.1 20.85,16.8 arc-90 19.93,17.73 v19.93,21.9
  Top 0.3: MUX1.P$6 15,16.25 arc90 14.5,16.75 14,16.75 arc-11 C12.1 | MUX2.P$6 22.5,16.25 arc90 22,16.75 21.5,16.75
  Top 0.5: IC2.4 32.21,42.81 arc90 C24.1 33.02,43.1 arc-90 33.9,42.23 33.9,40.33 arc-90 33.27,39.7 arc90 32.5,38.92 32.5,37.5 arc90 33.45,36.55 C9.1 | REG1.1 35.4,36.55 C9.1 | 34.48,26.23 arc90 v34.75,26.5 arc-90 34.35,26.1 28.15,26.1 arc58 26.18,25.07 arc6 25.85,24.52 arc-62 24.33,23.6 v20.6,23.6 | v32.55,32.25 32.55,35.35 arc-90 C9.1
  Bottom 0.2: v21.8,15.65 21.7,15.4 arc-22 v20.68,13.8
  Bottom 0.5: v19.93,21.9 19.93,22.93 arc-90 v20.6,23.6 | v34.75,26.5 34.75,28.5 arc90 33.75,29.5 arc-90 32.55,30.7 v32.55,32.25
ADC_CNVST
  Top 0.2: ADC1.6 42.35,6 arc90 45.27,8.93 45.27,18.68 arc-90 46.3,19.7 51.52,19.7 arc90 52.2,20.38 U1.P$23
DEBUG_LED  (via drill 0.35)
  Top 0.2: U1.P$2 52.2,29.7 arc-90 v53,30.5 | v55.42,30.5 55.42,30.68 arc-90 57.58,32.83 57.77,32.83 arc90 R24.1
  Bottom 0.2: v53,30.5 v55.42,30.5
FIBRE_TX  (via drill 0.35)
  Top 0.2: U1.P$25 54.8,22.2 arc-90 v55.37,21.63 | v56.15,19.82 arc-90 57.05,18.92 R21.1
  Bottom 0.2: v55.37,21.63 55.37,20.6 arc90 v56.15,19.82
MISO
  Top 0.2: ADC1.7 42.28,6.5 arc90 44.88,9.09 44.88,18.75 arc-34 45.1,19.57 arc29 45.27,20.12 arc51 45,20.8 arc-48 44.62,21.65 arc-90 45.17,22.2 U1.P$16
MOSI
  Top 0.2: ADC1.9 42.23,7.5 arc90 44.12,9.39 44.12,22.27 arc-90 44.85,23 U1.P$15
N$1
  Top 0.5: IC2.1 IC2.2
N$2
  Top 0.2: IC1.9 21.95,7.2 arc-90 22.25,6.9 | 22.25,6.9 arc-90 21.9,6.55 IC1.8 | R17.1 23.15,6 arc-90 22.25,6.9
N$4
  Top 0.2: R21.2 59.9,18 arc-90 60.92,16.98 60.92,15.03 arc90 T1.B
N$5
  Top 0.2: R16.2 14.45,5.5 20,5.5 arc90 20.5,6 20.5,7.5 arc-90 20.85,7.85 IC1.10 23.4,7.85 arc90 R15.2
N$6
  Top 0.2: R17.2 27.9,6 arc-90 D1.3 arc-90 28.15,6.05 C21.1 arc-90 31.45,7 ADC1.3
N$7
  Top 0.2: R23.2 arc90 59.2,13.75 61.45,13.75 arc90 62,14.3 T1.C
N$8
  Top 0.2: C30.1 arc90 46.6,33.65 Y1.1 46.6,30.82 arc56 46.83,30.4 arc-60 U1.P$8
N$9
  Top 0.2: REF1.P$5 27.3,12.25 arc-90 C19.1
N$10
  Top 0.2: C31.1 Y1.3 48.95,30.7 arc-65 48.7,30.35 arc60 48.23,29.75 arc12 U1.P$7
N$11
  Top 0.3: JP1.1 37.5,26 arc-90 36.5,25 28.25,25 arc60 26.98,24 arc-68 24.75,22.5 23,22.5 | MUX1.P$5 15,19.25 arc90 15.5,18.75 16,18.75 arc90 16.5,19.25 MUX1.P$2 16.5,21 arc-90 18,22.5 22,22.5 | MUX2.P$2 24,19.25 arc-90 23.5,18.75 23,18.75 arc-90 22.5,19.25 MUX2.P$5 22.5,22 | 22,22.5 23,22.5 | 22.5,22 arc90 22,22.5 | 22.5,22 arc-90 23,22.5
N$12
  Top 0.3: C4.1 R3.1 7.5,19.25 arc-90 8.25,20 10.5,20 arc28 11.5,20.25 arc18 12,20.62 arc-38 14.25,21.75 15,21.75 arc-90 16,20.75 MUX1.P$3
N$14
  Top 0.2: R22.2 arc-90 2,10.96 arc84 T2.B
N$15  (1 unrouted)
  Top 0.2: TRIM1.W arc90 10.62,9.07 C17.2 11.25,10.5 arc-90 12,9.75 arc90 12.4,9.35 14.25,9.35 arc56 14.75,9.62 arc-57 15.07,9.8 IC1.2 | TRIM1.B 5.8,6.1 arc90 6.3,5.6 10.6,5.6 arc90 11,6 11,6.97 | 11,6.97 arc-90 11.38,7.35 | 11,6.97 arc90 10.6,7.38 10.5,7.38 arc90 10.53,7.35 11.38,7.35 | 11.38,7.35 14.4,7.35 arc-19 15,7.25 IC1.6
N$16
  Top 0.5: T1.E 62.95,12.04 arc-90 60.41,9.5 55,9.5 arc-90 54,10.5 arc90 53.19,11.31 XT1.1
N$17
  Top 0.2: 57.42,23.88 arc6 57.57,23.64 56.92,22.8 57.4,22.32 58.24,22.97 arc23 59.15,22.59 59.29,21.54 59.96,21.54 60.1,22.59 arc23 61.01,22.97 61.85,22.32 62.33,22.8 61.68,23.64 arc23 62.06,24.55 63.11,24.69 63.11,25.36 62.06,25.5 arc23 61.68,26.41 62.33,27.25 61.85,27.73 61.01,27.08 arc23 60.1,27.46 59.96,28.51 59.29,28.51 59.15,27.46 arc23 58.24,27.08 57.4,27.73 56.92,27.25 57.57,26.41 arc6 57.42,26.17 58.62,25.55 arc-62 59.62,26.15 arc-243 58.62,24.5 57.42,23.88
N$20
  Top 0.2: R13.1 4,6.2 arc-90 R12.2 arc90 4.95,5.25 11.3,5.25 arc90 11.45,5.4 arc90 R16.1 arc-90 13.05,7 14.5,7 arc-44 14.88,6.85 arc41 IC1.7
N$21
  Top 0.2: R11.1 R10.2
N$22
  Top 0.2: 17.5,11.95 arc-90 R14.1 | R13.2 4,9 arc90 4.5,8.5 6.85,8.5 arc90 7.25,8.9 7.25,11 arc-90 7.83,11.57 9.6,11.57 arc90 9.85,11.82 9.85,13.2 arc-90 10.25,13.6 11.55,13.6 arc-90 12.32,12.82 12.32,12.28 arc90 12.9,11.7 13.97,11.7 arc-49 14.53,11.45 arc56 14.85,11.32 16.88,11.32 arc90 17.5,11.95 | IC1.3 16.15,9.15 arc90 16.5,9.5 16.5,10.8 arc-70 16.9,11.38 arc47 17.5,11.95
N$24  (1 unrouted)
  Top 0.2: R4.2 11.5,16.55 arc90 12.15,15.9 14.15,15.9 arc-90 14.57,15.47 14.57,14.9 arc44 14.75,14.4 arc49 15.97,13.85 arc-1 17.75,13.85 arc-23 19.05,13.57 arc-5 21.25,12.5 arc-61 22.12,11.03 22.12,9.45 arc-90 21.82,9.15 IC1.12 21.45,9.15 | 5,19.75 4.95,19.8 3.48,19.8 arc90 3.2,19.52 3.2,18.1 arc90 3.6,17.7 4.15,17.7 arc-67 C4.2
  Top 0.3: IC2.7 18.73,37.73 arc90 18,37 18,30.59 arc90 18.54,30.05 19.36,30.05 | 19.36,30.05 R7.1 arc90 26.05,30 30.5,30 arc-90 32,28.5 arc90 33,27.5 35.5,27.5 | 19.36,30.05 arc90 R2.2 | R4.2 C5.2 R3.2 C4.2 arc-90 5.45,16.75 5,16.75 | 5.95,16.8 arc-90 5.5,17.25 5.55,17.25 | 36.5,27.5 38.5,27.5 arc-90 39.5,26.5 39.5,25.5 arc-90 38.5,24.5 33,24.5 arc90 32.25,23.75 32.25,21.25 arc90 33.5,20 34.75,20 arc-90 35.75,19 35.75,17.25 arc-90 35.3,16.8 C7.2 R6.2 C6.2 R5.2 arc90 28,16.3 | 36.5,27.5 35.5,27.5 | 36,27 36,26 arc-90 35.5,25.5 28.25,25.5 arc67 26.45,24.25 arc-68 24.6,23 18,23 arc31 16.62,22.62 arc-31 15.25,22.25 14.27,22.25 arc31 12.45,21.63 arc5 11.46,20.89 arc-39 10.37,20.5 8.38,20.5 arc37 7.25,20.12 arc-37 6.12,19.75 5,19.75 4.88,19.75 | 36,27 arc90 35.5,27.5 | 36,27 arc-90 36.5,27.5
  Top 0.5: IC2.7 23.27,37.73
N$25
  Top 0.2: 13.75,14.75 C15.1 13.85,14.36 | R8.1 arc-90 15.45,13.3 | IC1.14 21.38,10.45 | 21.38,10.45 20.88,10.45 arc180 20.88,9.82 arc-5 IC1.13 | 21.38,10.45 21.38,10.97 arc90 20.35,12 R14.2 arc18 18.8,13.1 arc50 17.95,13.5 16.2,13.5 arc90 R8.1 | 13.85,14.36 14.03,14.2 | R8.1 13.85,14.36
N$26
  Top 0.2: U1.P$29 53.8,25.4 arc-90 53.3,25.9 53.3,27.77 arc-49 53.55,28.32 arc48 53.73,28.7 53.73,33.33 arc90 C29.2 R18.1
N$27
  Top 0.2: 13.12,12.32 arc-90 R8.2 | 11.25,14.1 arc-90 C15.2 | C15.2 10.4,14.75 | C15.2 10.6,14.55 | C15.2 arc-90 10.95,14.4 arc-30 12.12,13.82 13.37,12.75 R8.2 | C15.2 7.7,14.75 R9.2 arc90 6.4,13.45 6.4,13.25 arc-90 5.72,12.57 R10.1 | R8.2 13.82,12.75 arc-90 14.57,12 arc90 14.82,11.75 16.3,11.75 arc90 16.5,11.95 16.5,12.78 arc-90 16.82,13.1 18.15,13.1 arc-90 18.5,12.75 arc-1 18.5,11.47 arc-65 18.1,10.86 arc13 17.6,10.55 arc54 17.2,9.7 arc-3 17.2,9.12 arc-50 16.65,8.03 arc-39 16.15,7.85 IC1.5
N$28
  Top 0.2: R24.2 58.52,36.42 58.52,38.98 LED1.A
N$29
  Top 0.2: 39.4,13.05 C16.1 39.45,13.05 arc-90 38.88,12.47 38.73,12.47 arc90 38.35,12.1 38.35,11.66 arc-90 VREG2.4
N$30
  Top 0.3: MUX2.P$4 23,20.75 arc-90 24.25,22 27,22 arc-90 28.25,20.75 28.25,20.5 arc90 28.75,20 31.2,20 arc-90 R6.1 C7.1 arc90 34.45,18.75
N$31
  Top 0.2: J1.3 58.48,40.5 arc90 57.95,39.98 57.95,36.9 arc-90 R19.2
N$32  (via drill 0.35)
  Top 0.2: J1.4 v59.11,37.96 arc90 v59.1,37.95 | R20.2 arc-90 56.08,37.02 57.35,37.02 arc90 v57.4,37.08
  Bottom 0.2: v57.4,37.08 58.12,37.35 arc22 v59.1,37.95
N$33
  Top 0.3: MUX2.P$3 23.5,20.75 arc-90 24.25,21.5 26.75,21.5 arc-90 27.75,20.5 27.75,19.5 arc90 28.5,18.75 | 28.5,18.75 R5.1 28.3,18.7 arc-90 28,19 | C6.1 arc90 30.45,18.75 28.5,18.75
N$34
  Top 0.3: 11.5,19.25 11.5,18.82 | 11.5,18.82 R4.1 C5.1 | MUX1.P$4 15.5,20.65 arc90 14.9,21.25 14.5,21.25 arc39 12.68,20.6 arc35 11.5,18.82
N$35
  Top 0.2: TRIM1.A 5.72,9.9 | 5.72,9.9 5.81,9.81 5.81,10.06 arc90 5.3,10.57 3.45,10.57 arc90 3,10.12 3,6.7 arc-90 R12.1 2.3,6.1 | 5.72,9.9 5.67,9.95
N$36  (via drill 0.35)
  Top 0.5: Q1.3 39.92,43.1 arc-90 41.33,41.7 41.33,27.32 arc-90 v41,27
  Bottom 0.5: v41,27 41,20.54 arc90 43.54,18 TP4.TP
N$37
  Top 0.2: IC1.1 13.47,10.45 C17.1 13.05,10.5 arc-90 12,11.55 arc90 10.97,12.57 R11.2
N$38
  Top 0.5: TP1.TP arc-90 50.6,18.1 PMOS1.3
PV_A+  (via drill 0.35)
  Top 0.2: R23.1 arc90 58,14.95 58,15.05 arc-90 C33.1
  Top 0.5: C1.1 arc-90 33.9,34.1 REG2.3 arc-90 37.55,35.15 39.83,35.15 | R23.1 56.85,14 arc-90 PMOS1.2 arc90 55.45,16.4 55.45,20.45 arc-90 56,21 arc90 56.25,21.25 56.25,30.8 arc-90 57.55,32.1 59.25,32.1 arc90 v60.3,33.15 | 39.83,35.15 40.12,35.15 | 39.83,35.15 arc90 40.55,35.88 40.55,41.38 arc90 39.92,42 36,42 arc-90 35,43 35,44.52 arc-90 36,45.52 46.27,45.52 arc-90 VREG1.3 46.3,47.3 arc-90 47,48 59.08,48 arc-90 v60.3,46.77
  Bottom 0.5: v60.3,46.77 v60.3,33.15
PV_B-
  Top 0.5: C2.1 37.6,36.55 REG1.2 arc90 37.75,36.7 37.75,40.6 Q1.2
REED_RELAY
  Top 0.2: D2.3 arc-90 2.8,16.85 2.8,20
  Top 0.5: RLY1.P$3 9.84,21.71 arc-90 9.25,21.12 8.62,21.12 arc32 6.88,20.62 arc-32 6,20.38 3.17,20.38 arc90 2.8,20 | D2.3 T2.C
REED_RELAY_CTRL
  Top 0.2: 1.4,7.45 arc-90 R22.1 arc90 1.4,7.45 | 1.4,7.45 1.4,5.2 arc90 1.73,4.88 39.08,4.88 arc90 39.4,5.2 arc-90 39.73,5.53 42.34,5.53 arc90 45.67,8.87 45.67,11 | 45.67,11 45.67,11.2 | 45.67,11 arc-90 47.3,12.62 52.62,12.62 arc90 54,14 54,16.48 arc-90 54.52,17 arc90 54.9,17.38 54.9,19.1 arc90 54.38,19.62 53.38,19.62 arc-90 53,20 U1.P$24
RESET
  Top 0.2: J1.2 62.2,43.69 59.14,43.69 arc90 57.58,42.12 57.58,38.3 arc-90 56.73,37.45 54.5,37.45 arc90 C29.1
RX
  Top 0.2: 54.38,26.23 arc-90 U1.P$30 55.15,26.2 arc90 55.75,26.8 55.75,28.48 arc90 55.12,29.1 arc-90 54.8,29.43 54.8,30.57 arc-52 55.9,32.85 arc16 57,34 R19.1
SCLK  (via drill 0.35)
  Top 0.2: ADC1.8 42.34,7 arc90 44.5,9.16 44.5,19.9 arc-90 v44.7,20.1 | v46.7,20.25 46.85,20.25 arc90 U1.P$17
  Bottom 0.2: v44.7,20.1 46.55,20.1 arc90 v46.7,20.25
SEL_RNG_1
  Top 0.2: MUX2.P$10 24.52,15.03 arc85 24.62,14.93 arc29 25.88,15.2 arc-30 27.55,15.55 35,15.55 arc90 36.6,17.15 36.6,21.23 arc-90 38.77,23.4 arc6 39.55,23.5 arc27 39.77,23.6 arc15 40.52,24.35 arc-49 42.38,25.32 45.92,25.32 U1.P$12
SEL_RNG_2
  Top 0.2: MUX2.P$1 24.5,20.5 arc-90 25,21 26.75,21 arc-90 27.25,20.5 27.25,16.35 arc90 27.7,15.9 35.05,15.9 arc90 36.2,17.05 36.2,21.27 arc-90 38.73,23.8 39,23.8 arc71 39.98,24.5 arc-57 41.45,25.88 arc-14 43.17,26.1 45.85,26.1 arc-90 45.88,26.07 U1.P$11
SEL_RNG_3
  Top 0.2: MUX1.P$10 arc90 17.62,14.93 20.48,14.93 arc-49 21.73,14.43 arc46 22.25,14.2 25.15,14.2 arc27 25.88,14.38 arc-25 27.71,14.85 35.15,14.85 arc90 37.3,17 37.3,21 arc-90 38.98,22.68 39.33,22.68 arc45 40.7,23.25 arc-43 42.23,23.93 45.88,23.93 U1.P$14
SEL_RNG_4
  Top 0.2: MUX1.P$1 17,21 arc-90 18.02,22.02 18.73,22.02 arc-90 19.57,21.18 19.57,16.23 arc90 20.5,15.3 arc-12 21.15,15.2 arc-31 21.93,14.75 arc46 22.4,14.55 24.95,14.55 arc26 25.82,14.75 arc-25 27.72,15.2 35.05,15.2 arc90 36.95,17.1 36.95,21.1 arc-90 38.88,23.02 39.33,23.02 arc34 39.9,23.2 arc9 40.62,23.77 arc-40 42.52,24.57 45.98,24.57 U1.P$13
TX
  Top 0.2: R20.1 arc90 54.33,33.38 54.33,29.43 arc90 54.98,28.77 arc-90 55.4,28.35 55.4,27.2 arc-90 55.2,27 U1.P$31
VDD  (via drill 0.35)
  Top 0.2: ADC1.10 arc90 39.5,8.95 C26.1 40,9.55 arc90 40.5,10.05 40.5,21.9 arc90 v40.23,22.18 | U1.P$6 49.02,28.35 | 49.02,28.35 arc90 49.33,28.05 50.25,28.05 arc90 50.58,28.38 50.58,29.18 arc-90 U1.P$4 50.6,31.65 arc-90 C32.1 arc-90 50,32.35 50,34.95 arc-90 R18.2 | 49.02,28.35 arc-90 48.75,28.07 47.58,28.07 arc90 47.15,27.65 | 47.15,27.65 47.15,22.3 arc90 47.52,21.93 47.9,21.93 arc-90 48.2,21.62 U1.P$18 48.2,21.25 | 47.15,27.65 arc105 46.5,28.5 45.38,28.5 arc90 44.88,28 44.88,27.02 arc-90 44.4,26.55 43.5,26.55 43.25,26.55 42.7,26.55 arc34 v40.23,25.8
  Top 0.3: R18.2 arc-90 52.95,37.9 56.52,37.9 arc90 57.1,38.48 57.1,44.5 arc90 JP2.2
  Bottom 0.2: v40.23,25.8 v40.23,22.18
VREF
  Top 0.2: R15.1 arc-90 25.55,8.1 | 25.55,8.1 D1.2 27.05,8.3 arc-90 28.05,9.3 arc90 28.75,10 | C20.1 arc-90 25.55,10 25.55,8.1 | ADC1.1 arc-90 34.4,7.95 C22.2 arc90 31.2,9.25 29.5,9.25 arc-90 28.75,10 | REF1.P$6 27.88,11.32 arc-90 28.75,10.45 28.75,10

### Text on the board
tPlace: J1 | +5V | RST | Isolated Ammeter / pico to milli | RX | TX | GND | GND (bias) | Current In | - | + | GND | GND | Fibre Out
bPlace: Isolated Ammeter | Surrey Ion Beam Centre / Open Source Hardware